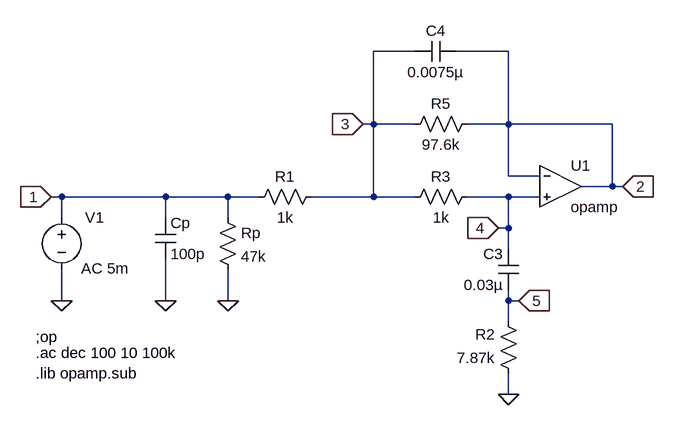
[diagram p0: schematic Op Amp Lipshitz_c Preamp V2.asc]
Op Amp Lipshitz_c Preamp V2.asc, the LTspice schematic file:
Version 4
SHEET 1 1876 1124
WIRE 272 -48 208 -48
WIRE 416 -48 336 -48
WIRE 208 64 208 -48
WIRE 208 64 192 64
WIRE 272 64 208 64
WIRE 416 64 416 -48
WIRE 416 64 352 64
WIRE 576 64 416 64
WIRE 416 144 416 64
WIRE 464 144 416 144
WIRE 576 160 576 64
WIRE 576 160 528 160
WIRE 592 160 576 160
WIRE -272 176 -288 176
WIRE -112 176 -272 176
WIRE -16 176 -112 176
WIRE 32 176 -16 176
WIRE 208 176 208 64
WIRE 208 176 112 176
WIRE 272 176 208 176
WIRE 416 176 352 176
WIRE 464 176 416 176
WIRE -272 208 -272 176
WIRE -112 208 -112 176
WIRE -16 208 -16 176
WIRE 416 224 416 176
WIRE 416 224 400 224
WIRE 416 256 416 224
WIRE -272 336 -272 288
WIRE -112 336 -112 272
WIRE -16 336 -16 288
WIRE 416 336 416 320
WIRE 432 336 416 336
WIRE 416 368 416 336
WIRE 416 480 416 448
FLAG -272 336 0
FLAG -288 176 1
IOPIN -288 176 In
FLAG -112 336 0
FLAG -16 336 0
FLAG 592 160 2
IOPIN 592 160 In
FLAG 432 336 5
IOPIN 432 336 In
FLAG 416 480 0
FLAG 192 64 3
IOPIN 192 64 In
FLAG 400 224 4
IOPIN 400 224 In
SYMBOL voltage -272 192 R0
WINDOW 3 24 44 Left 2
WINDOW 123 30 94 Left 2
WINDOW 0 36 16 Left 2
WINDOW 39 0 0 Left 2
SYMATTR Value ""
SYMATTR Value2 AC 5m
SYMATTR InstName V1
SYMBOL cap -128 208 R0
SYMATTR InstName Cp
SYMATTR Value 100p
SYMBOL res -32 192 R0
SYMATTR InstName Rp
SYMATTR Value 47k
SYMBOL OpAmps\\opamp 496 96 R0
SYMATTR InstName U1
SYMBOL cap 432 320 R180
WINDOW 0 24 56 Left 2
WINDOW 3 24 8 Left 2
SYMATTR InstName C3
SYMATTR Value 0.03µ
SYMBOL res 432 464 R180
WINDOW 0 36 76 Left 2
WINDOW 3 36 40 Left 2
SYMATTR InstName R2
SYMATTR Value 7.87k
SYMBOL res 368 48 R90
WINDOW 0 0 56 VBottom 2
WINDOW 3 32 56 VTop 2
SYMATTR InstName R5
SYMATTR Value 97.6k
SYMBOL cap 336 -64 R90
WINDOW 0 0 32 VBottom 2
WINDOW 3 32 32 VTop 2
SYMATTR InstName C4
SYMATTR Value 0.0075µ
SYMBOL res 128 160 R90
WINDOW 0 0 56 VBottom 2
WINDOW 3 32 56 VTop 2
SYMATTR InstName R1
SYMATTR Value 1k
SYMBOL res 368 160 R90
WINDOW 0 0 56 VBottom 2
WINDOW 3 32 56 VTop 2
SYMATTR InstName R3
SYMATTR Value 1k
TEXT -312 392 Left 2 !;op
TEXT -312 416 Left 2 !.ac dec 100 10 100k
TEXT -312 448 Left 2 !.lib opamp.sub

The netlist it stands for:
* Op Amp Lipshitz_c Preamp V2.asc
V1 1 0 AC 5m
Cp 1 0 100p
Rp 1 0 47k
XU1 2 4 2 opamp Aol=100K GBW=10Meg  ; pins invin noninvin out
C3 5 4 0.03µ
R2 0 5 7.87k
R5 2 3 97.6k
C4 2 3 0.0075µ
R1 3 1 1k
R3 4 3 1k
;op
.ac dec 100 10 100k
.lib opamp.sub
.backanno
.end